# EAGLE design vhdci-fx2-differential (EAGLE 6.5.0)
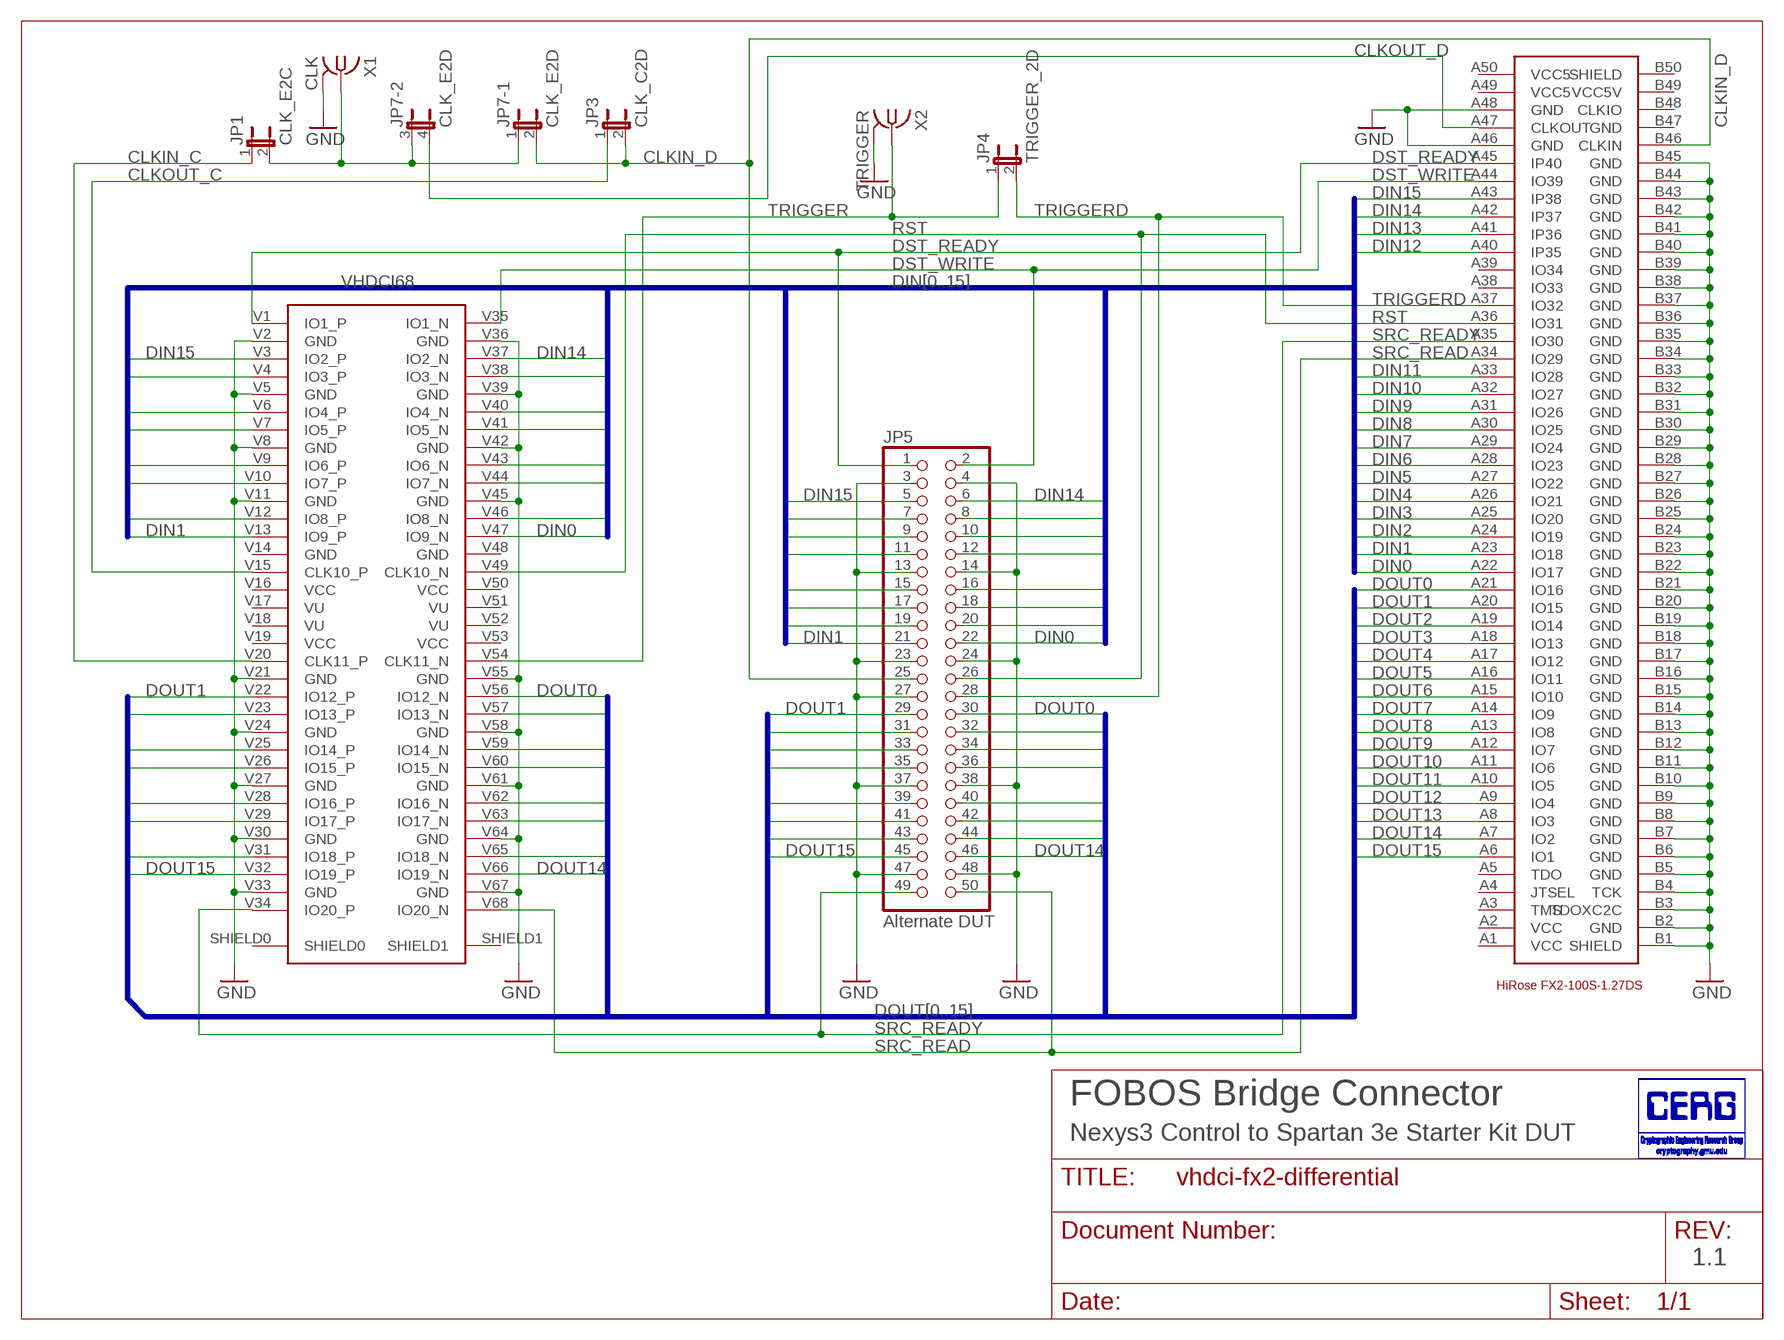
[diagram p0: schematic, sheet 1]

## Parts
DUT  HIROSE-FX2-100S-1.27DS  [HIROSE-FX2-100]
JP1  CLK_E2C  JP1E  [JP1]
JP3  CLK_C2D  JP1E  [JP1]
JP4  TRIGGER_2D  JP1E  [JP1]
JP5  Alternate DUT  PINHD-2X25  [2X25]
JP7  CLK_E2D  JP2QE  [JP2Q]
U$2  VHDCI68  [VHDCI68]
X1  CLK  BU-SMA-V  [BU-SMA-V]
X2  TRIGGER  BU-SMA-V  [BU-SMA-V]

## Nets
CLKIN_C: JP1.1 U$2.V20(CLK11_P)
CLKIN_D: DUT.B46(CLKIN) JP3.2 JP5.25 JP7.2
CLKOUT_C: JP3.1 U$2.V15(CLK10_P)
CLKOUT_D: DUT.A47(CLKOUT) JP7.4
DIN0: DUT.A22(IO17) JP5.22 U$2.V47(IO9_N)
DIN1: DUT.A23(IO18) JP5.21 U$2.V13(IO9_P)
DIN2: DUT.A24(IO19) JP5.20 U$2.V46(IO8_N)
DIN3: DUT.A25(IO20) JP5.19 U$2.V12(IO8_P)
DIN4: DUT.A26(IO21) JP5.18 U$2.V44(IO7_N)
DIN5: DUT.A27(IO22) JP5.17 U$2.V10(IO7_P)
DIN6: DUT.A28(IO23) JP5.16 U$2.V43(IO6_N)
DIN7: DUT.A29(IO24) JP5.15 U$2.V9(IO6_P)
DIN8: DUT.A30(IO25) JP5.12 U$2.V41(IO5_N)
DIN9: DUT.A31(IO26) JP5.11 U$2.V7(IO5_P)
DIN10: DUT.A32(IO27) JP5.10 U$2.V40(IO4_N)
DIN11: DUT.A33(IO28) JP5.9 U$2.V6(IO4_P)
DIN12: DUT.A40(IP35) JP5.8 U$2.V38(IO3_N)
DIN13: DUT.A41(IP36) JP5.7 U$2.V4(IO3_P)
DIN14: DUT.A42(IP37) JP5.6 U$2.V37(IO2_N)
DIN15: DUT.A43(IP38) JP5.5 U$2.V3(IO2_P)
DOUT0: DUT.A21(IO16) JP5.30 U$2.V56(IO12_N)
DOUT1: DUT.A20(IO15) JP5.29 U$2.V22(IO12_P)
DOUT2: DUT.A19(IO14) JP5.32 U$2.V57(IO13_N)
DOUT3: DUT.A18(IO13) JP5.31 U$2.V23(IO13_P)
DOUT4: DUT.A17(IO12) JP5.34 U$2.V59(IO14_N)
DOUT5: DUT.A16(IO11) JP5.33 U$2.V25(IO14_P)
DOUT6: DUT.A15(IO10) JP5.36 U$2.V60(IO15_N)
DOUT7: DUT.A14(IO9) JP5.35 U$2.V26(IO15_P)
DOUT8: DUT.A13(IO8) JP5.40 U$2.V62(IO16_N)
DOUT9: DUT.A12(IO7) JP5.39 U$2.V28(IO16_P)
DOUT10: DUT.A11(IO6) JP5.42 U$2.V63(IO17_N)
DOUT11: DUT.A10(IO5) JP5.41 U$2.V29(IO17_P)
DOUT12: DUT.A9(IO4) JP5.44 U$2.V65(IO18_N)
DOUT13: DUT.A8(IO3) JP5.43 U$2.V31(IO18_P)
DOUT14: DUT.A7(IO2) JP5.46 U$2.V66(IO19_N)
DOUT15: DUT.A6(IO1) JP5.45 U$2.V32(IO19_P)
DST_READY: DUT.A45(IP40) JP5.1 U$2.V1(IO1_P)
DST_WRITE: DUT.A44(IO39) JP5.2 U$2.V35(IO1_N)
GND: DUT.A46(GND) DUT.A48(GND) DUT.B1(SHIELD) DUT.B2(GND) DUT.B3(TDOXC2C) DUT.B4(TCK) DUT.B5(GND) DUT.B6(GND) DUT.B7(GND) DUT.B8(GND) DUT.B9(GND) DUT.B10(GND) DUT.B11(GND) DUT.B12(GND) DUT.B13(GND) DUT.B14(GND) DUT.B15(GND) DUT.B16(GND) DUT.B17(GND) DUT.B18(GND) DUT.B19(GND) DUT.B20(GND) DUT.B21(GND) DUT.B22(GND) DUT.B23(GND) DUT.B24(GND) DUT.B25(GND) DUT.B26(GND) DUT.B27(GND) DUT.B28(GND) DUT.B29(GND) DUT.B30(GND) DUT.B31(GND) DUT.B32(GND) DUT.B33(GND) DUT.B34(GND) DUT.B35(GND) DUT.B36(GND) DUT.B37(GND) DUT.B38(GND) DUT.B39(GND) DUT.B40(GND) DUT.B41(GND) DUT.B42(GND) DUT.B43(GND) DUT.B44(GND) DUT.B45(GND) JP5.3 JP5.4 JP5.13 JP5.14 JP5.23 JP5.24 JP5.27 JP5.37 JP5.38 JP5.47 JP5.48 U$2.V2(GND) U$2.V5(GND) U$2.V8(GND) U$2.V11(GND) U$2.V21(GND) U$2.V24(GND) U$2.V27(GND) U$2.V30(GND) U$2.V33(GND) U$2.V36(GND) U$2.V39(GND) U$2.V42(GND) U$2.V45(GND) U$2.V55(GND) U$2.V58(GND) U$2.V61(GND) U$2.V64(GND) U$2.V67(GND) X1.2(GND) X2.2(GND)
N$3: JP1.2 JP7.1 JP7.3 X1.1
RST: DUT.A36(IO31) JP5.26 U$2.V49(CLK10_N)
SRC_READ: DUT.A34(IO29) JP5.50 U$2.V68(IO20_N)
SRC_READY: DUT.A35(IO30) JP5.49 U$2.V34(IO20_P)
TRIGGER: JP4.1 U$2.V54(CLK11_N) X2.1
TRIGGERD: DUT.A37(IO32) JP4.2 JP5.28
Unconnected: DUT.A3(TMS) DUT.A4(JTSEL) DUT.A5(TDO) DUT.A38(IO33) DUT.A39(IO34) DUT.B48(CLKIO) DUT.B50(SHIELD) U$2.SHIELD0 U$2.SHIELD1 U$2.V14(GND) U$2.V48(GND)

## Buses
DOUT[0..15]
DIN[0..15]

## Notes on the sheet
- FOBOS Bridge Connector
- Nexys3 Control to Spartan 3e Starter Kit DUT
- 1.1

## Power pins joined to a net without a drawn wire
GND: DUT.B47(GND) X1.3(GND) X1.4(GND) X1.5(GND) X2.3(GND) X2.4(GND) X2.5(GND)
VCC: DUT.A1(VCC) DUT.A2(VCC) U$2.V16(VCC) U$2.V19(VCC) U$2.V50(VCC) U$2.V53(VCC)
VCC5: DUT.A49(VCC5) DUT.A50(VCC5)
VCC5V: DUT.B49(VCC5V)
VU: U$2.V17(VU) U$2.V18(VU) U$2.V51(VU) U$2.V52(VU)

## Library data of the parts
DUT = hirose-fx2-100:HIROSE-FX2-100S-1.27DS
JP1 JP3 JP4 = jumper:JP1E: JUMPER
JP5 = pinhead:PINHD-2X25: PIN HEADER
JP7 = jumper:JP2QE: JUMPER
U$2 = tw:VHDCI68: Nexys 3 VHDCI 68pin 0.8mm pitch
X1 X2 = con-coax:BU-SMA-V: FEMALE SMA CONNECTOR Radiall distributor RS 112-3794; OC_FARNELL: unknown; OC_NEWARK: unknown

## Board
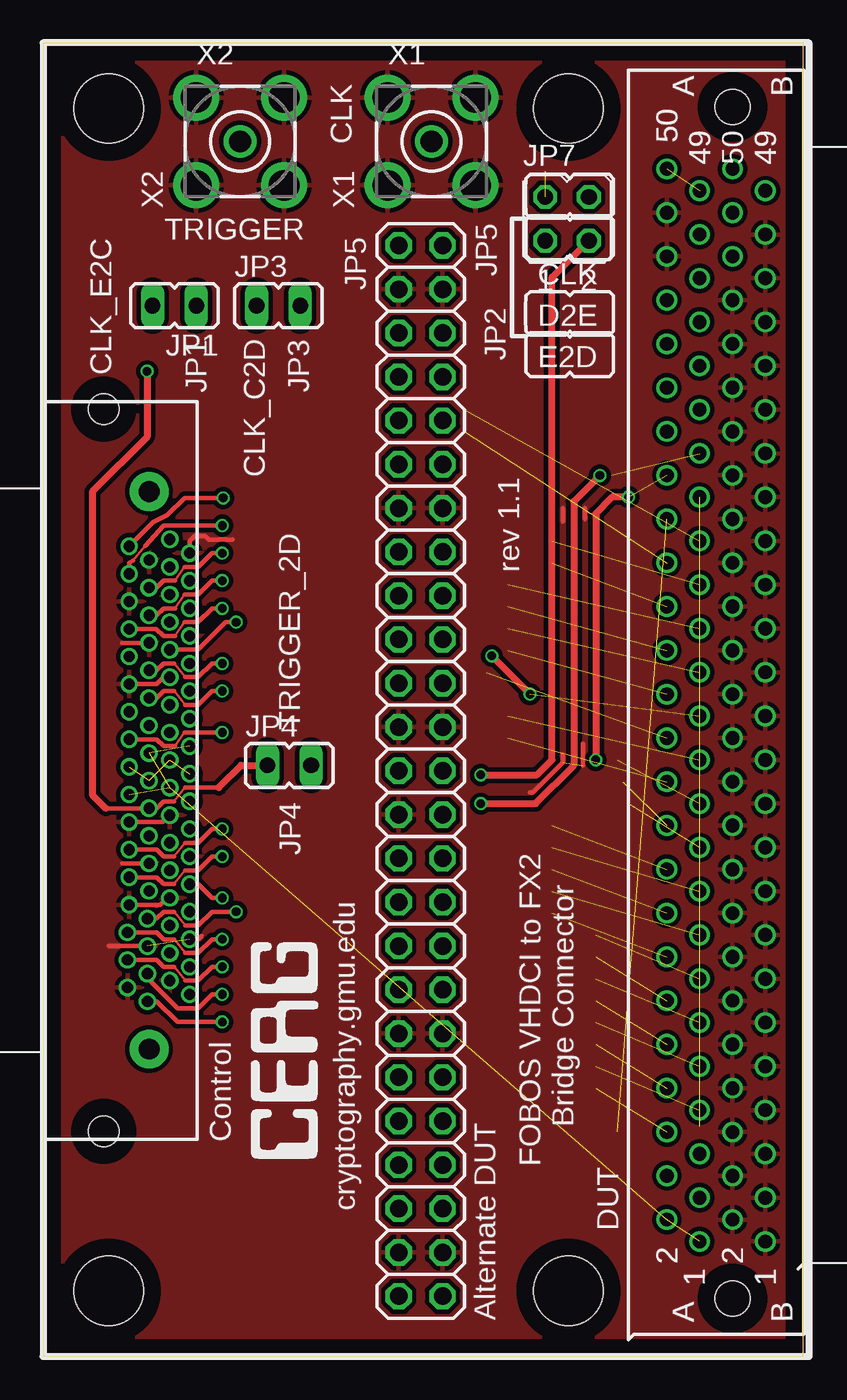
[diagram p1: board, top side]
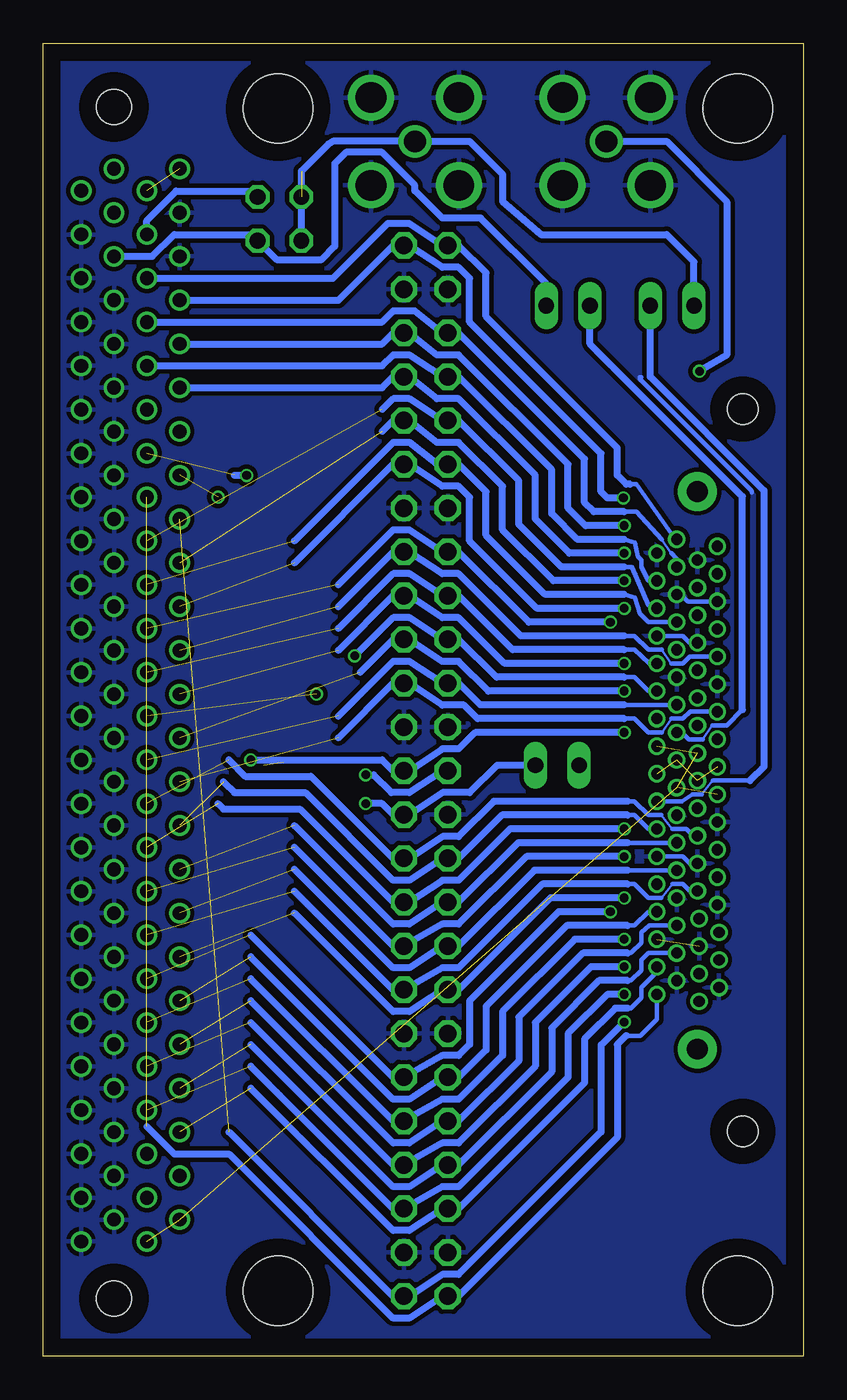
[diagram p2: board, bottom side, seen from below]

Size 44.12 x 76.19 mm. Coordinates in mm from the lower left corner, seen from the top.
Outline: 0,0 44.12,0 44.12,76.19 0,76.19 0,0
Copper layers (1*16): Top 0.035mm / dielectric 1.5mm / Bottom 0.035mm
Design rules "gldpoenix-unproven": minimum track width 5mil, minimum drill 15mil, track to track 5mil, track to pad 5mil, pad to pad 5mil, via to via 5mil, smd to smd 5mil, copper to edge 40mil, drill to drill 8mil, minimum pad ring 7mil, minimum via ring 5mil, stop-mask expansion 4mil, vias tented up to drill 20mil, thermal gap 10mil
Holes 4 mm at 3.81,72.39 3.81,3.81 30.48,3.81 30.48,72.39

### Footprints (pad centres in the part's own frame; a part is rotated, then mirrored left to right if it is on the bottom)
HIROSE-FX2-100 = drill 0.8: A1 17.78,5.08; A2 16.51,3.175; A3 15.24,5.08; A4 13.97,3.175; A5 12.7,5.08; A6 11.43,3.175; A7 10.16,5.08; A8 8.89,3.175; A9 7.62,5.08; A10 6.35,3.175; A11 5.08,5.08; A12 3.81,3.175; A13 2.54,5.08; A14 1.27,3.175; A15 0,5.08; A16 -1.27,3.175; A17 -2.54,5.08; A18 -3.81,3.175; A19 -5.08,5.08; A20 -6.35,3.175; A21 -7.62,5.08; A22 -8.89,3.175; A23 -10.16,5.08; A24 -11.43,3.175; A25 -12.7,5.08; A26 -13.97,3.175; A27 -15.24,5.08; A28 -16.51,3.175; A29 -17.78,5.08; A30 -19.05,3.175; A31 -20.32,5.08; A32 -21.59,3.175; A33 -22.86,5.08; A34 -24.13,3.175; A35 -25.4,5.08; A36 -26.67,3.175; A37 -27.94,5.08; A38 -29.21,3.175; A39 -30.48,5.08; A40 -31.75,3.175; A41 -33.02,5.08; A42 -34.29,3.175; A43 -35.56,5.08; A44 -36.83,3.175; A45 -38.1,5.08; A46 -39.37,3.175; A47 -40.64,5.08; A48 -41.91,3.175; A49 -43.18,5.08; A50 -44.45,3.175; B1 17.78,8.89; B2 16.51,6.985; B3 15.24,8.89; B4 13.97,6.985; B5 12.7,8.89; B6 11.43,6.985; B7 10.16,8.89; B8 8.89,6.985; B9 7.62,8.89; B10 6.35,6.985; B11 5.08,8.89; B12 3.81,6.985; B13 2.54,8.89; B14 1.27,6.985; B15 0,8.89; B16 -1.27,6.985; B17 -2.54,8.89; B18 -3.81,6.985; B19 -5.08,8.89; B20 -6.35,6.985; B21 -7.62,8.89; B22 -8.89,6.985; B23 -10.16,8.89; B24 -11.43,6.985; B25 -12.7,8.89; B26 -13.97,6.985; B27 -15.24,8.89; B28 -16.51,6.985; B29 -17.78,8.89; B30 -19.05,6.985; B31 -20.32,8.89; B32 -21.59,6.985; B33 -22.86,8.89; B34 -24.13,6.985; B35 -25.4,8.89; B36 -26.67,6.985; B37 -27.94,8.89; B38 -29.21,6.985; B39 -30.48,8.89; B40 -31.75,6.985; B41 -33.02,8.89; B42 -34.29,6.985; B43 -35.56,8.89; B44 -36.83,6.985; B45 -38.1,8.89; B46 -39.37,6.985; B47 -40.64,8.89; B48 -41.91,6.985; B49 -43.18,8.89; B50 -44.45,6.985 | hole 2: 21.09,6.984; -48.032,6.985
JP1 = drill 0.914 long: 1 0,-1.27; 2 0,1.27
2X25 = drill 1.016 octagon: 1 -30.48,-1.27; 2 -30.48,1.27; 3 -27.94,-1.27; 4 -27.94,1.27; 5 -25.4,-1.27; 6 -25.4,1.27; 7 -22.86,-1.27; 8 -22.86,1.27; 9 -20.32,-1.27; 10 -20.32,1.27; 11 -17.78,-1.27; 12 -17.78,1.27; 13 -15.24,-1.27; 14 -15.24,1.27; 15 -12.7,-1.27; 16 -12.7,1.27; 17 -10.16,-1.27; 18 -10.16,1.27; 19 -7.62,-1.27; 20 -7.62,1.27; 21 -5.08,-1.27; 22 -5.08,1.27; 23 -2.54,-1.27; 24 -2.54,1.27; 25 0,-1.27; 26 0,1.27; 27 2.54,-1.27; 28 2.54,1.27; 29 5.08,-1.27; 30 5.08,1.27; 31 7.62,-1.27; 32 7.62,1.27; 33 10.16,-1.27; 34 10.16,1.27; 35 12.7,-1.27; 36 12.7,1.27; 37 15.24,-1.27; 38 15.24,1.27; 39 17.78,-1.27; 40 17.78,1.27; 41 20.32,-1.27; 42 20.32,1.27; 43 22.86,-1.27; 44 22.86,1.27; 45 25.4,-1.27; 46 25.4,1.27; 47 27.94,-1.27; 48 27.94,1.27; 49 30.48,-1.27; 50 30.48,1.27
JP2Q = drill 0.914 octagon: 1 -1.27,-1.27; 2 1.27,-1.27; 3 -1.27,1.27; 4 1.27,1.27
VHDCI68 = drill 1.2 pad 2.25: SHIELD0 18.375,-0.4; SHIELD1 -13.975,-0.4 | drill 0.65 pad 1: V1 -11.2,0.8; V2 -10.4,1.95; V3 -9.6,0.8; V4 -8.8,1.95; V5 -8,0.8; V6 -7.2,1.95; V7 -6.4,0.8; V8 -5.6,1.95; V9 -4.8,0.8; V10 -4,1.95; V11 -3.2,0.8; V12 -2.4,1.95; V13 -1.6,0.8; V14 -0.8,1.95; V15 0,0.8; V16 0.8,1.95; V17 1.6,0.8; V18 2.4,1.95; V19 3.2,0.8; V20 4,1.95; V21 4.8,0.8; V22 5.6,1.95; V23 6.4,0.8; V24 7.2,1.95; V25 8,0.8; V26 8.8,1.95; V27 9.6,0.8; V28 10.4,1.95; V29 11.2,0.8; V30 12,1.95; V31 12.8,0.8; V32 13.6,1.95; V33 14.4,0.8; V34 15.2,1.95; V35 -10.8,-1.55; V36 -10,-0.4; V37 -9.2,-1.55; V38 -8.4,-0.4; V39 -7.6,-1.55; V40 -6.8,-0.4; V41 -6,-1.55; V42 -5.2,-0.4; V43 -4.4,-1.55; V44 -3.6,-0.4; V45 -2.8,-1.55; V46 -2,-0.4; V47 -1.2,-1.55; V48 -0.4,-0.4; V49 0.4,-1.55; V50 1.2,-0.4; V51 2,-1.55; V52 2.8,-0.4; V53 3.6,-1.55; V54 4.4,-0.4; V55 5.2,-1.55; V56 6,-0.4; V57 6.8,-1.55; V58 7.6,-0.4; V59 8.4,-1.55; V60 9.2,-0.4; V61 10,-1.55; V62 10.8,-0.5; V63 11.6,-1.65; V64 12.4,-0.5; V65 13.2,-1.65; V66 14,-0.5; V67 14.8,-1.65; V68 15.6,-0.5 | hole 1.75: -18.75,-3.025; 23.15,-3.025
BU-SMA-V = drill 1.27: 1 0,0 | drill 1.778: 2 -2.55,2.55; 3 2.55,2.55; 4 2.55,-2.55; 5 -2.55,-2.55

### Placement (x,y rotation side)
DUT  33.02,24.45 270 top
JP1  7.62,60.96 90 top
JP3  13.65,60.96 270 top
JP4  14.29,34.29 270 top
JP5  21.91,33.97 270 top
JP7  30.4,66 0 top
U$2  6.55,36.2 270 top
X1  22.54,70.48 0 top
X2  11.43,70.48 0 top

### Tracks (layer width: path | path; a pad name or v marks a point on that pad's centre or on a via)
CLKIN_C
  Bottom 0.127: 5.9,32.6 5.25,33.4
  Bottom 0.254: U$2.V20 7.05,32.2 6.45,32.6 5.9,32.6 | 5.25,33.4 3.1,33.4
  Bottom 0.406: JP1.1 8.89,56.83 2.3,50.24 2.3,34.2 3.1,33.4
CLKIN_D  (via drill 0.5)
  Top 0.406: JP7.2 29.56,62.62 29.53,62.62 29.53,34.61 28.66,33.74 v25.4,33.74
  Bottom 0.406: JP5.25 20.95,33.97 22.86,32.7 23.9,32.7 24.94,33.74 v25.4,33.74 | JP3.2 14.92,62.23 18.73,66.04 20.95,66.04 22.54,67.63 22.54,67.94 24.45,69.85 26.55,69.85 27.2,69.2 27.2,64.4 28,63.6 30.54,63.6 JP7.2 32.03,65.09 36.51,65.09 37.78,63.82 DUT.B46
CLKOUT_C
  Bottom 0.127: 5.85,35.8 5.3,36.6
  Bottom 0.254: U$2.V15 7.05,36.2 6.65,35.8 5.85,35.8 | 5.3,36.6 4.45,36.6 3.53,37.52
  Bottom 0.406: 3.53,37.52 3.53,49.89 12.38,58.74 JP3.1
CLKOUT_D
  Bottom 0.406: DUT.A47 38.1,65.9 36.4,67.6 32,67.6 JP7.4
DIN0  (1 unrouted)
  Bottom 0.127: 7.65,37 8.2,36.2
  Bottom 0.254: U$2.V47 6.55,37.4 7,37 7.65,37 | 8.2,36.2 9,36.2 9.8,37 10.4,37
  Bottom 0.406: 10.4,37 18.9,37 19.68,37.78 20.95,37.78 22.86,39.05 JP5.22 23.81,39.05 26.99,35.88
DIN1  (1 unrouted)
  Bottom 0.254: U$2.V13 10.4,37.8
  Bottom 0.406: 10.4,37.8 18.75,37.8 20,39.05 JP5.21 20.95,39.05 22.86,40.32 23.81,40.32 26.99,37.15
DIN2  (via drill 0.5)  (1 unrouted)
  Top 0.127: 7.6,38.6 8.25,37.8
  Top 0.254: U$2.V46 6.6,38.2 7,38.6 7.6,38.6 | 8.25,37.8 9,37.8 9.8,38.6 v10.4,38.6
  Bottom 0.406: v10.4,38.6 18.28,38.6 20,40.32 20.95,40.32 22.86,41.59 JP5.20 23.81,41.59 25.72,39.69
DIN3  (via drill 0.5)  (1 unrouted)
  Top 0.406: v28.26,38.42 v26.04,40.64
  Bottom 0.254: U$2.V12 9,38.6 9.8,39.4 10.4,39.4
  Bottom 0.406: 10.4,39.4 17.81,39.4 20,41.59 JP5.19 20.95,41.59 22.86,42.86 23.81,42.86 v26.04,40.64
DIN4  (via drill 0.5)  (1 unrouted)
  Top 0.127: 7.6,40.2 8.25,39.4
  Top 0.254: U$2.V44 6.55,39.8 7,40.2 7.6,40.2 | 8.25,39.4 9,39.4 9.8,40.2 v10.4,40.2
  Bottom 0.406: v10.4,40.2 17.34,40.2 20,42.86 20.95,42.86 22.86,44.13 JP5.18 23.81,44.13 26.99,40.96
DIN5  (1 unrouted)
  Bottom 0.254: U$2.V10 8.95,40.2 9.8,41 10.4,41
  Bottom 0.406: 10.4,41 16.87,41 20,44.13 JP5.17 20.95,44.13 22.86,45.4 23.81,45.4 26.99,42.23
DIN6  (1 unrouted)
  Bottom 0.127: 7.65,40.2 8.2,41
  Bottom 0.254: U$2.V43 6.6,40.6 7,40.2 7.65,40.2 | 8.2,41 9,41 9.8,41.8 10.4,41.8
  Bottom 0.406: 10.4,41.8 16.4,41.8 20,45.4 20.95,45.4 22.86,46.67 JP5.16 23.81,46.67 26.99,43.5
DIN7  (via drill 0.5)  (1 unrouted)
  Top 0.254: U$2.V9 arc-1 8.95,41 9,41 10.6,42.6 v11.2,42.6
  Bottom 0.406: v11.2,42.6 15.93,42.6 20,46.67 JP5.15 20.95,46.67 22.86,47.94 23.81,47.94 26.99,44.77
DIN8  (via drill 0.5)  (1 unrouted)
  Top 0.127: 7.65,41.8 8.2,42.6
  Top 0.254: U$2.V41 6.55,42.2 7,41.8 7.65,41.8 | 8.2,42.6 9,42.6 9.8,43.4 v10.4,43.4
  Bottom 0.406: v10.4,43.4 15.46,43.4 19.37,47.31 19.37,49.85 20,50.48 20.95,50.48 22.86,51.75 JP5.12 23.81,51.75 29.53,46.04
DIN9  (1 unrouted)
  Bottom 0.254: U$2.V7 8.99,42.59 9.5,43.1 9.78,44.02 10.4,44.2
  Bottom 0.406: 10.4,44.2 14.99,44.2 18.41,47.62 18.41,50.16 20,51.75 JP5.11 21.27,51.75 22.86,53.02 23.81,53.02 29.53,47.31
DIN10  (via drill 0.5)  (1 unrouted)
  Top 0.127: 7.65,43.4 8.2,44.2
  Top 0.254: U$2.V40 6.6,43 7,43.4 7.65,43.4 | 8.2,44.2 9,44.2 9.8,45 v10.4,45
  Bottom 0.406: v10.4,45 14.52,45 17.46,47.94 17.46,50.48 20,53.02 21.27,53.02 22.86,54.29 JP5.10 23.81,54.29 24.45,53.66
DIN11  (1 unrouted)
  Bottom 0.254: U$2.V6 9,43.6 9.95,45.8 10.4,45.8
  Bottom 0.406: 10.4,45.8 14.05,45.8 16.51,48.26 16.51,50.8 20,54.29 JP5.9 20.95,54.29 22.86,55.56 23.81,55.56 24.45,54.93
DIN12  (via drill 0.5)
  Top 0.127: 7.65,45 8.2,45.8
  Top 0.254: U$2.V38 6.6,44.6 7,45 7.65,45 | 8.2,45.8 9,45.8 9.8,46.6 v10.4,46.6
  Bottom 0.406: v10.4,46.6 13.58,46.6 15.56,48.58 15.56,51.12 20,55.56 21.27,55.56 22.86,56.83 JP5.8 23.81,56.83 24.45,56.2 DUT.A40
DIN13
  Bottom 0.254: U$2.V4 9,45 9.4,45.8 9.4,46.2 9.6,46.4 9.78,47.23 10.4,47.4
  Bottom 0.406: 10.4,47.4 13.11,47.4 14.61,48.9 14.61,51.44 20,56.83 JP5.7 20.95,56.83 22.86,58.1 23.81,58.1 24.45,57.47 DUT.A41
DIN14  (via drill 0.5)
  Top 0.127: 5.22,46.17 5.92,47.02
  Top 0.254: U$2.V37 5,46 5.02,46.07 5.22,46.17 | 5.92,47.02 7,48.2 v10.4,48.2
  Bottom 0.406: v10.4,48.2 12.64,48.2 13.65,49.21 13.65,51.75 20,58.1 21.27,58.1 22.86,59.37 JP5.6 23.81,59.37 24.45,58.74 DUT.A42
DIN15
  Bottom 0.127: 7.65,46.6 8.2,47.4
  Bottom 0.254: U$2.V3 7.35,46.25 7.65,46.6 | 8.2,47.4 9.7,49 10.4,49
  Bottom 0.406: 10.4,49 12.17,49 12.7,49.53 12.7,52.07 20,59.37 JP5.5 20.95,59.37 22.54,60.64 23.81,60.64 24.45,60.01 DUT.A43
DOUT0  (1 unrouted)
  Bottom 0.127: 7.6,30.6 8.25,31.4
  Bottom 0.254: U$2.V56 6.4,30.2 6.8,30.6 7.6,30.6 | 8.25,31.4 9,31.4 9.8,32.2 10.2,32.2
  Bottom 0.406: 33.34,34.61 32.38,33.66 28.57,33.66 23.81,28.89 JP5.30 22.86,28.89 20.95,30.16 20,30.16 17.96,32.2 10.2,32.2
DOUT1  (1 unrouted)
  Bottom 0.254: U$2.V22 9,30.6 9.8,31.4 10.2,31.4
  Bottom 0.406: 33.66,33.34 33.02,32.7 28.89,32.7 23.81,27.62 22.86,27.62 20.95,28.89 JP5.29 20,28.89 17.5,31.4 10.2,31.4
DOUT2  (via drill 0.5)  (1 unrouted)
  Top 0.127: 7.6,29 8.25,29.8
  Top 0.254: U$2.V57 6.6,29.4 7,29 7.6,29 | 8.25,29.8 9,29.8 9.8,30.6 v10.4,30.6
  Bottom 0.406: 33.97,32.07 33.66,31.75 29.21,31.75 23.81,26.35 JP5.32 22.86,26.35 20.95,27.62 20,27.62 17.02,30.6 v10.4,30.6
DOUT3  (1 unrouted)
  Bottom 0.254: U$2.V23 10.2,29.8
  Bottom 0.406: 29.53,30.8 23.81,25.08 22.86,25.08 20.95,26.35 JP5.31 20,26.35 16.55,29.8 10.2,29.8
DOUT4  (via drill 0.5)  (1 unrouted)
  Top 0.127: 7.6,27.4 8.25,28.2
  Top 0.254: U$2.V59 6.6,27.8 7,27.4 7.6,27.4 | 8.25,28.2 9,28.2 9.8,29 v10.4,29
  Bottom 0.406: v10.4,29 16.09,29 20,25.08 20.95,25.08 JP5.34 23.81,23.81 29.53,29.53
DOUT5  (1 unrouted)
  Bottom 0.254: U$2.V25 10.2,28.2
  Bottom 0.406: 10.2,28.2 15.62,28.2 20,23.81 JP5.33 20.95,23.81 22.86,22.54 23.81,22.54 29.53,28.26
DOUT6  (1 unrouted)
  Bottom 0.127: 7.6,27.4 8.25,26.6
  Bottom 0.254: U$2.V60 6.6,27 7,27.4 7.6,27.4 | 8.25,26.6 9,26.6 9.8,27.4 10.2,27.4
  Bottom 0.406: 10.2,27.4 15.14,27.4 20,22.54 20.95,22.54 JP5.36 23.81,21.27 29.53,26.99
DOUT7  (via drill 0.5)  (1 unrouted)
  Top 0.254: U$2.V26 9,27.4 9.8,26.6 v10.4,26.6
  Bottom 0.406: v10.4,26.6 14.68,26.6 20,21.27 JP5.35 20.95,21.27 22.86,20 23.81,20 29.53,25.72
DOUT8  (via drill 0.5)  (1 unrouted)
  Top 0.127: 7.6,25.8 8.25,25
  Top 0.254: U$2.V62 6.6,25.4 7,25.8 7.6,25.8 | 8.25,25 9,25 9.8,25.8 v11.2,25.8
  Bottom 0.406: v11.2,25.8 14.21,25.8 19.37,20.64 19.37,18.1 20,17.46 20.95,17.46 JP5.40 23.81,16.19 32.07,24.45
DOUT9  (1 unrouted)
  Bottom 0.254: U$2.V28 9,25.8 9.8,25 10.2,25
  Bottom 0.406: 10.2,25 13.73,25 18.41,20.32 18.41,17.78 20,16.19 JP5.39 20.95,16.19 22.86,14.92 23.81,14.92 32.07,23.18
DOUT10  (via drill 0.5)  (1 unrouted)
  Top 0.127: 7.6,24.2 8.25,23.4
  Top 0.254: U$2.V63 6.6,24.6 7,24.2 7.6,24.2 | 8.25,23.4 9,23.4 9.8,24.2 v10.4,24.2
  Bottom 0.406: v10.4,24.2 13.27,24.2 17.46,20 17.46,17.46 20,14.92 20.95,14.92 JP5.42 23.81,13.65 32.07,21.91
DOUT11  (1 unrouted)
  Bottom 0.254: U$2.V29 8.95,25 9.4,24.6 9.4,24 10,23.4 10.2,23.4
  Bottom 0.406: 10.2,23.4 12.79,23.4 16.51,19.68 16.51,17.14 20,13.65 JP5.41 20.95,13.65 22.86,12.38 23.81,12.38 32.07,20.64
DOUT12  (via drill 0.5)  (1 unrouted)
  Top 0.127: 7.6,22.6 8.25,21.8
  Top 0.254: U$2.V65 6.6,23 7,22.6 7.6,22.6 | 8.25,21.8 9,21.8 9.8,22.6 v10.4,22.6
  Bottom 0.406: v10.4,22.6 12.32,22.6 15.56,19.37 15.56,16.83 20,12.38 20.95,12.38 JP5.44 23.81,11.11 32.07,19.37
DOUT13  (1 unrouted)
  Bottom 0.254: U$2.V31 9,23.4 9.4,23 9.4,22.4 10,21.8 10.2,21.8
  Bottom 0.406: 10.2,21.8 11.86,21.8 14.61,19.05 14.61,16.51 20,11.11 JP5.43 20.95,11.11 22.86,9.84 23.81,9.84 32.07,18.1
DOUT14  (via drill 0.5)  (1 unrouted)
  Top 0.254: U$2.V66 6.05,21.95 7.8,20.2 9,20.2 9.8,21 v10.4,21
  Bottom 0.406: v10.4,21 11.38,21 13.65,18.73 13.65,16.19 20,9.84 20.95,9.84 JP5.46 23.81,8.57 32.07,16.83
DOUT15  (1 unrouted)
  Bottom 0.254: U$2.V32 8.5,22.3 9.4,21.4 9.4,20.8 10,20.2 10.2,20.2
  Bottom 0.406: 10.2,20.2 10.91,20.2 12.7,18.41 12.7,15.88 20,8.57 JP5.45 20.95,8.57 22.86,7.3 23.81,7.3 32.07,15.56
DST_READY
  Bottom 0.254: U$2.V1 7.45,47.45 9.69,50.6 10.05,50.6
  Bottom 0.406: 10.05,50.6 10.28,50.6 10.79,51.12 10.79,52.7 18.41,60.33 18.41,62.87 20,64.45 JP5.1 20.95,64.45 22.86,65.72 24.13,65.72 27.3,62.55 DUT.A45
DST_WRITE  (via drill 0.5)
  Top 0.254: v10.45,49.8 8.2,49.8 7.2,48.8 6.4,48.4 U$2.V35
  Bottom 0.406: v10.45,49.8 11.38,49.8 11.75,50.16 11.75,52.39 19.37,60.01 19.37,62.55 20,63.18 20.95,63.18 22.86,64.45 JP5.2 23.81,64.45 26.99,61.28 DUT.A44
GND  (2 unrouted)
  Top 0.254: 31.33,34.29 31.33,35.56 | 28.26,32.7 28.42,32.7 30.16,34.45 30.16,34.92 | 30.16,49.21 30.16,48.42 | 31.43,49.21 31.43,48.58 | U$2.V42 4.6,41.4 | U$2.V58 4.6,28.6 | U$2.V55 6.95,31 U$2.V21 | U$2.V2 8.5,47.3 8.8,47.6 9.4,47.6 9.6,47.4 11,47.4 | U$2.V27 7.2,26.6 6.8,26.2 U$2.V61 | U$2.V11 7,39.4 6.6,39 U$2.V45 | U$2.V30 9,24.2 9.2,24.4 | U$2.V64 3.8,23.8
  Bottom 0.254: 3,50.1 3,50.2 9.5,56.7 9.5,56.8 9.4,56.8 | U$2.V58 6.6,28.6 7,29 U$2.V24 | U$2.V42 6.6,41.4 7,41.8 U$2.V8 | U$2.V5 7.1,44.2 6.7,43.8 U$2.V39
  pour Top (isolate 0.254): 0,76.2 44.13,76.2 44.13,0 0,0
  pour Bottom (isolate 0.254): 0,76.2 44.13,76.2 44.13,0 0,0
N$3  (1 unrouted)
  Bottom 0.406: JP1.2 6.35,63.5 7.94,65.09 15.24,65.09 17.46,66.99 17.46,68.58 19.37,70.48 X1.1 27.3,70.48 27.56,70.33 29.13,68.76 JP7.1
RST  (via drill 0.5)  (1 unrouted)
  Top 0.127: 7.65,35.4 8.2,36.2
  Top 0.254: U$2.V49 6.6,35.8 7,35.4 7.65,35.4 | 8.2,36.2 v10.39,36.2
  Top 0.406: v32.07,34.61 32.07,48.9 33.02,49.85 v33.97,49.85
  Bottom 0.406: v10.39,36.2 19.05,36.2 20,35.24 20.95,35.24 22.86,33.97 JP5.26 23.81,33.97 24.45,34.61 v32.07,34.61
SRC_READ  (via drill 0.5)  (1 unrouted)
  Top 0.254: v10.4,19.4 7.8,19.4 6.6,20.6 U$2.V68
  Bottom 0.406: 33.34,13.02 23.81,3.49 JP5.50 22.86,3.49 20.95,4.76 20,4.76 11.75,13.02 11.75,18.1 11.7,18.1 v10.4,19.4
SRC_READY  (1 unrouted)
  Bottom 0.254: U$2.V34 8.5,19.55 9.45,18.6 10.25,18.6
  Bottom 0.406: 10.25,18.6 10.29,18.6 10.79,18.1 10.79,12.7 20,3.49 JP5.49 20.95,3.49 22.86,2.22 23.81,2.22 33.34,11.75 36.51,11.75 38.1,13.34
TRIGGER  (via drill 0.5)
  Top 0.127: 7.6,32.2 8.25,33
  Top 0.254: 3.64,31.79 3.64,31.8 U$2.V54 6.6,31.8 7,32.2 7.6,32.2 | 8.25,33 10.2,33
  Top 0.406: JP4.1 11.49,34.29 10.2,33 | v6.03,57.15 6.03,53.34 2.86,50.16 2.86,32.58 3.64,31.79
  Bottom 0.406: X2.1 7.94,70.48 4.45,66.99 4.45,58.1 v6.03,57.15
TRIGGERD  (via drill 0.5)  (1 unrouted)
  Top 0.406: v25.4,32.07 28.57,32.07 30.8,34.29 30.8,49.59 v32.31,51.1
  Bottom 0.406: JP4.2 17.78,34.29 19.37,32.7 20.95,32.7 22.86,31.43 JP5.28 23.81,31.43 24.45,32.07 v25.4,32.07 | v32.31,51.1 33.01,51.1 33.02,51.12
VCC  (5 unrouted)
VCC5  (1 unrouted)
VU  (3 unrouted)

### Text on the board
_tsilk: CLK | A | B | 50 | 49 | 49 | X2 | X1 | TRIGGER | JP5 | CLK | CLK_E2C | D2E | JP1 | CLK_C2D | JP3 | JP2 | E2D | rev 1.1 | TRIGGER_2D | JP4 | FOBOS VHDCI to FX2 / Bridge Connector | Control | cryptography.gmu.edu | DUT | 2 | 2 | 1 | 1 | A | B | Alternate DUT
200bmp: /home/jkaps/public_html/cerg/design/CERG-logo-with-url-bw.bmp